# Altium project PCB_Project.PrjPcb
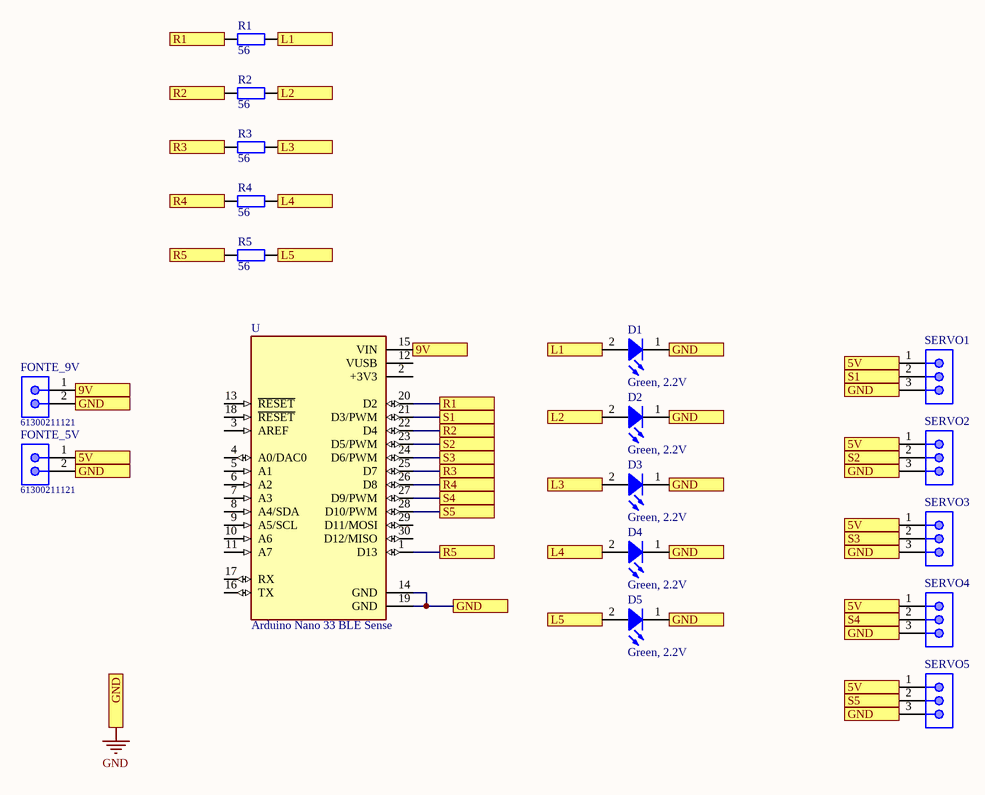
[diagram p0: Sheet1.SchDoc]
1 sheet, 18 parts. Net scope: flat (ports and power ports of the same name join across sheets).
Board file: PCB1.PcbDoc

## Sheet Sheet1.SchDoc
size A4; SheetNumber: 1; SheetTotal: 1

### Parts
D1  Green, 2.2V  [LED GREEN 3MM]
D2  Green, 2.2V  [LED GREEN 3MM]
D3  Green, 2.2V  [LED GREEN 3MM]
D4  Green, 2.2V  [LED GREEN 3MM]
D5  Green, 2.2V  [LED GREEN 3MM]
FONTE_5V  61300211121  [61300211121]
FONTE_9V  61300211121  [61300211121]
R1  value 56  [RES AXIAL-0.4]  (hidden comment: Res)
R2  value 56  [RES AXIAL-0.4]  (hidden comment: Res)
R3  value 56  [RES AXIAL-0.4]  (hidden comment: Res)
R4  value 56  [RES AXIAL-0.4]  (hidden comment: Res)
R5  value 56  [RES AXIAL-0.4]  (hidden comment: Res)
SERVO1  61300311121  [61300311121]  (value not drawn)
SERVO2  61300311121  [61300311121]  (value not drawn)
SERVO3  61300311121  [61300311121]  (value not drawn)
SERVO4  61300311121  [61300311121]  (value not drawn)
SERVO5  61300311121  [61300311121]  (value not drawn)
U  Arduino Nano 33 BLE Sense  [MODULE_ABX00027]

### Ports
5V, 9V, GND, L1, L2, L3, L4, L5, R1, R2, R3, R4, R5, S1, S2, S3, S4, S5

### Nets
GND: D1.1(K) D2.1(K) D3.1(K) D4.1(K) D5.1(K) FONTE_5V.2 FONTE_9V.2 SERVO1.3 SERVO2.3 SERVO3.3 SERVO4.3 SERVO5.3 U.14(GND) U.19(GND) ; port GND
NetD1_2: D1.2(A) R1.2 ; port L1
NetD2_2: D2.2(A) R2.2 ; port L2
NetD3_2: D3.2(A) R3.2 ; port L3
NetD4_2: D4.2(A) R4.2 ; port L4
NetD5_2: D5.2(A) R5.2 ; port L5
NetFONTE_5V_1: FONTE_5V.1 SERVO1.1 SERVO2.1 SERVO3.1 SERVO4.1 SERVO5.1 ; port 5V
NetFONTE_9V_1: FONTE_9V.1 U.15(VIN) ; port 9V
NetR1_1: R1.1 U.20(D2) ; port R1
NetR2_1: R2.1 U.22(D4) ; port R2
NetR3_1: R3.1 U.25(D7) ; port R3
NetR4_1: R4.1 U.26(D8) ; port R4
NetR5_1: R5.1 U.1(D13) ; port R5
NetSERVO1_2: SERVO1.2 U.21(D3/PWM) ; port S1
NetSERVO2_2: SERVO2.2 U.23(D5/PWM) ; port S2
NetSERVO3_2: SERVO3.2 U.24(D6/PWM) ; port S3
NetSERVO4_2: SERVO4.2 U.27(D9/PWM) ; port S4
NetSERVO5_2: SERVO5.2 U.28(D10/PWM) ; port S5

Not connected (* = marked no-connect by the designer): U 2(+3V3) 3(AREF) 4(A0/DAC0) 5(A1) 6(A2) 7(A3) 8(A4/SDA) 9(A5/SCL) 10(A6) 11(A7) 12(VUSB) 13(~{RESET}) 16(TX) 17(RX) 18(~{RESET}) 29(D11/MOSI) 30(D12/MISO)

### Library data of the parts
D1-D5 = LED: LED WL-TMRC THT Mono-color Round; Part Number: 151051BS04000; Luminous Intensity: 500mcd; Dominant Wavelength: 470nm; Emitting Color: Blue; Forward Voltage: 3.2V; Peak Wavelength: 465nm; Chip Technology: GaN; Viewing Angle: 40deg; ComponentLink1Description: Manufacturer; ComponentLink1URL: http://www.we-online.de; ComponentLink2Description: Datasheet; ComponentLink2URL: https://katalog.we-online.de/led/datasheet/151051BS04000.pdf; Operating Temperature: -40 to +85degC; Mounting Technology: THT; Packaging: Bulk; Published Date: October 2019; Publisher: Wurth Elektronik; Size: 5mm
FONTE_5V FONTE_9V = 61300211121: WR-PHD Pin Header, THT, pitch 2.54mm, Single Row, Vertical, 2pin; Pin Number: 2; Gender: Male; Rated Current: 3A; Working Voltage: 250VAC; Withstanding Voltage: 500VAC; Contact Resistance: 20mOhm; ComponentLink1Description: Manufacturer; ComponentLink1URL: http://www.we-online.de; ComponentLink2Description: Datasheet; ComponentLink2URL: https://katalog.we-online.de/em/datasheet/6130xx11121.pdf; Part Number: 61300211121; Published Date: June 2019; Publisher: Wurth Elektronik; Pitch: 2.54mm; Operating Temperature: -40 to +105degC; Mounting Technology: THT; Packaging: Bag; Row Number: Single; Orientation: Vertical
R1-R5 = Res: Resistor; Published: 8-Jun-2000; LatestRevisionDate: 17-Jul-2002; LatestRevisionNote: Re-released for DXP Platform.; PackageReference: AXIAL-0.4; Publisher: Altium Limited; PackageDescription: Axial Device, Thru-Hole; 2 Leads; 0.4 in Pin Spacing
SERVO1-SERVO5 = 61300311121: WR-PHD Pin Header, THT, pitch 2.54mm, Single Row, Vertical, 3pin; Pin Number: 3; Gender: Male; Rated Current: 3A; Working Voltage: 250VAC; Withstanding Voltage: 500VAC; Contact Resistance: 20mOhm; ComponentLink1Description: Manufacturer; ComponentLink1URL: http://www.we-online.de; ComponentLink2Description: Datasheet; ComponentLink2URL: https://katalog.we-online.de/em/datasheet/6130xx11121.pdf; Part Number: 61300311121; Published Date: June 2019; Publisher: Wurth Elektronik; Pitch: 2.54mm; Operating Temperature: -40 to +105degC; Mounting Technology: THT; Packaging: Bag; Row Number: Single; Orientation: Vertical
U = Arduino Nano 33 BLE Sense: ATSAMD21G18A Arduino Nano 33 IoT SAM D ARMÂ® CortexÂ®-M0 + MCU Ù‡ÛŒØ¦Øª Ù…Ø¯ÛŒØ±Ù‡ Ø§Ø±Ø²ÛŒØ§Ø¨ÛŒ Ø¬Ø§Ø³Ø§Ø²ÛŒ Ø´Ø¯Ù‡ 32 Ø¨ÛŒØªÛŒ; MP: ABX00027; Package: None; Availability: Unavailable; SnapEDA_Link: https://www.snapeda.com/parts/ABX00027/Arduino/view-part/3949339/?ref=snap; DigiKey-Purchase-URL: https://snapeda.com/shop?store=DigiKey&id=3949339; Value: *; MF: Arduino; Price: None; Mouser-Purchase-URL: https://snapeda.com/shop?store=Mouser&id=3949339